# EAGLE design MainBoard (EAGLE 8.2.2)
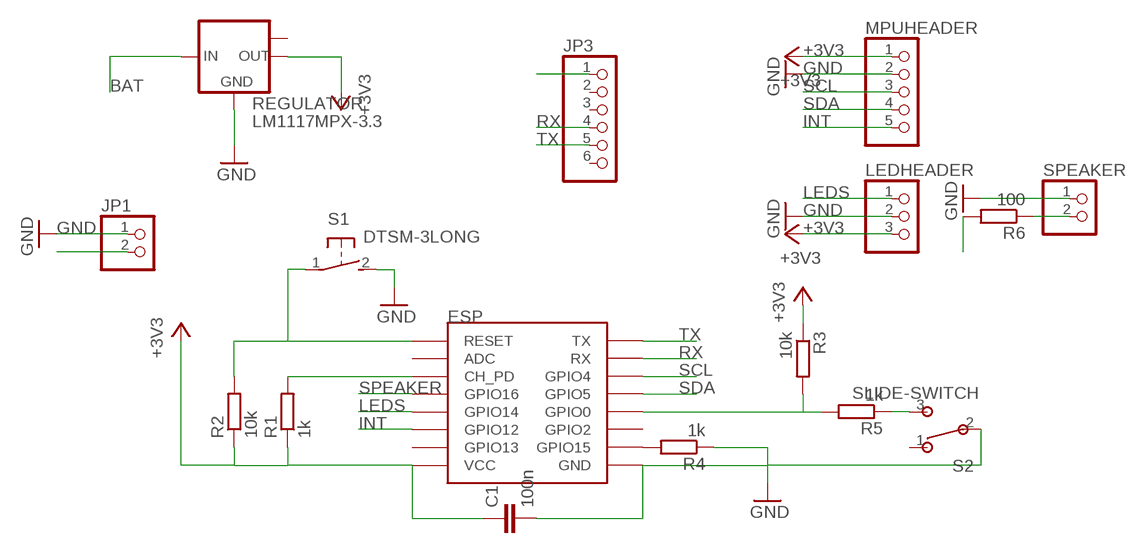
[diagram p0: schematic, sheet 1]

## Parts
C1  100n  C-EUC1206  [C1206]
ESP  ESP12SMD  [ESP12-SMD]
JP1  PINHD-1X2  [1X02]
JP3  PINHD-1X6  [1X06]
LEDHEADER  PINHD-1X3  [1X03]
MPUHEADER  PINHD-1X5  [1X05]
R1  1k  R-EU_R1206  [R1206]
R2  10k  R-EU_R1206  [R1206]
R3  10k  R-EU_R1206  [R1206]
R4  1k  R-EU_R1206  [R1206]
R5  1k  R-EU_R1206  [R1206]
R6  100  R-EU_R1206  [R1206]
REGULATOR  LM1117MPX-3.3  [SOT223]
S1  DTSM-3LONG  [DTSM-3LONG]
S2  SLIDE-SWITCH  [AYZ0102AGRLC]
SPEAKER  PINHD-1X2  [1X02]

## Nets
+3V3: C1.1 ESP.VCC LEDHEADER.3 MPUHEADER.1 R1.1 R2.1 R3.1 REGULATOR.2(OUT)
BAT: JP1.2 REGULATOR.3(IN)
GND: C1.2 ESP.GND JP1.1 JP3.1 LEDHEADER.2 MPUHEADER.2 R4.1 REGULATOR.1(GND) S1.2 S2.2 SPEAKER.1
INT: ESP.GPIO12 MPUHEADER.5
LEDS: ESP.GPIO14 LEDHEADER.1
N$1: ESP.GPIO0 R3.2 R5.2
N$2: ESP.CH_PD R1.2
N$3: ESP.RESET R2.2 S1.1
N$5: ESP.GPIO15 R4.2
N$9: R5.1 S2.3
N$11: R6.1 SPEAKER.2
RX: ESP.RXD0(RX) JP3.4
SCL: ESP.GPIO4 MPUHEADER.3
SDA: ESP.GPIO5 MPUHEADER.4
SPEAKER: ESP.GPIO16 R6.2
TX: ESP.TXD0(TX) JP3.5
Unconnected: ESP.ADC ESP.GPIO2 ESP.GPIO13 JP3.2 JP3.3 JP3.6 REGULATOR.TAB(OUT1) S2.1

## Library data of the parts
C1 = resistor:C-EU: CAPACITOR, European symbol
ESP = esp8266modules:ESP12: ESP8266 Wifi module 12
JP1 SPEAKER = pinhead:PINHD-1X2: PIN HEADER
JP3 = pinhead:PINHD-1X6: PIN HEADER
LEDHEADER = pinhead:PINHD-1X3: PIN HEADER
MPUHEADER = pinhead:PINHD-1X5: PIN HEADER
R1-R6 = resistor:R-EU_: RESISTOR, European symbol
REGULATOR = lm1117:LM1117MPX-*
S1 = switch-tact:DTSM-3
S2 = fab:SLIDE-SWITCH: SMD slide-switch AYZ0102AGRLC as found in the fablab inventory. Includes the mounting holes. Made by Zaerc.

## Board
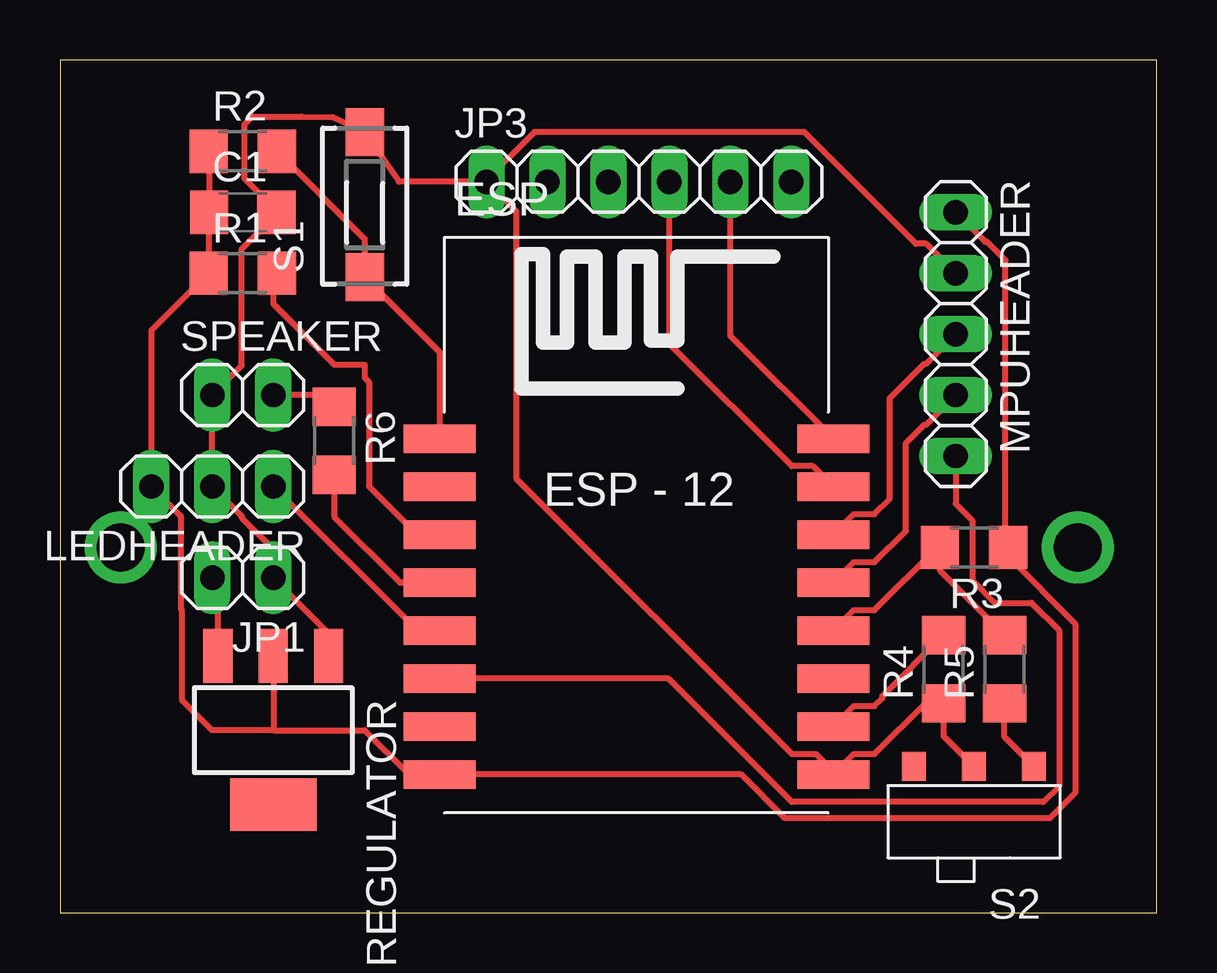
[diagram p1: board, top side]

Size 45.72 x 35.56 mm. Coordinates in mm from the lower left corner, seen from the top.
Outline: 0,0 45.72,0 45.72,35.56 0,35.56 0,0
Copper layers (1*16): Top 0.035mm / dielectric 1.5mm / Bottom 0.035mm
Design rules "fabmodule": minimum track width 10mil, minimum drill 0.4mm, track to track 0.42mm, track to pad 0.42mm, pad to pad 0.42mm, via to via 0.42mm, smd to smd 0.42mm, copper to edge 40mil, drill to drill 0.8mm, minimum pad ring 10mil, minimum via ring 8mil, stop-mask expansion 4mil, vias tented up to drill 0mil, thermal gap 10mil

### Footprints (pad centres in the part's own frame; a part is rotated, then mirrored left to right if it is on the bottom)
C1206 = smd 1.6 x 1.8: 1 -1.4,0; 2 1.4,0
ESP12-SMD = smd 3 x 1.2: ADC -8.3,3.8; CH_PD -8.3,1.8; GND 8.1,-8.2; GPIO0 8.1,-2.2; GPIO2 8.1,-4.2; GPIO4 8.1,1.8; GPIO5 8.1,-0.2; GPIO12 -8.3,-4.2; GPIO13 -8.3,-6.2; GPIO14 -8.3,-2.2; GPIO15 8.1,-6.2; GPIO16 -8.3,-0.2; RESET -8.3,5.8; RXD0 8.1,3.8; TXD0 8.1,5.8; VCC -8.3,-8.2
1X02 = drill 1.016 long: 1 -1.27,0; 2 1.27,0
1X06 = drill 1.016 long: 1 -6.35,0; 2 -3.81,0; 3 -1.27,0; 4 1.27,0; 5 3.81,0; 6 6.35,0
1X03 = drill 1.016 long: 1 -2.54,0; 2 0,0; 3 2.54,0
1X05 = drill 1.016 long: 1 -5.08,0; 2 -2.54,0; 3 0,0; 4 2.54,0; 5 5.08,0
R1206 = smd 1.6 x 1.803: 1 -1.422,0; 2 1.422,0
SOT223 = smd 1.219 x 2.235: 1 -2.311,-3.099; 2 0,-3.099; 3 2.311,-3.099 | smd 3.6 x 2.2: TAB 0,3.099
DTSM-3LONG = smd 2 x 1.6: 1 -2.7,0; 2 3.335,0
AYZ0102AGRLC = smd 1 x 1.2: 1 2.5,-2.3; 2 0,-2.3; 3 -2.5,-2.3

### Placement (x,y rotation side)
C1  7.62,29.21 0 top
ESP  24.13,13.97 0 top
JP1  7.62,13.97 180 top
JP3  24.13,30.48 0 top
LEDHEADER  6.35,17.78 180 top
MPUHEADER  37.34,24.13 270 top
R1  7.62,26.67 0 top
R2  7.62,31.75 0 top
R3  38.1,15.24 180 top
R4  36.83,10.16 90 top
R5  39.37,10.16 90 top
R6  11.43,19.68 270 top
REGULATOR  8.89,7.62 180 top
S1  12.7,29.21 90 top
S2  38.1,3.81 180 top
SPEAKER  7.62,21.59 0 top

### Tracks (layer width: path | path; a pad name or v marks a point on that pad's centre or on a via)
+3V3
  Top 0.254: R2.1 6.22,31.73 C1.1 6.2,29.19 R1.1 3.81,24.28 LEDHEADER.3 5.04,16.55 5.04,12.67 5.08,12.63 5.08,8.89 6.35,7.62 8.91,7.62 | ESP.VCC 15.7,5.77 | MPUHEADER.1 38.57,27.98 38.64,27.98 39.41,27.21 39.41,15.35 R3.1 39.52,14.86 42.32,12.06 42.32,5 41.27,3.95 30.22,3.95 28.4,5.77 ESP.VCC | 8.78,10.61 REGULATOR.2 8.91,10.69 8.91,7.62 | 8.91,7.62 12.7,7.62 14.55,5.77 ESP.VCC
BAT
  Top 0.254: JP1.2 6.58,13.74 REGULATOR.3
GND
  Top 0.254: S2.2 36.83,7.38 R4.1 36.07,8.74 33.96,6.62 33.08,6.62 32.3,5.84 | 32.3,5.84 ESP.GND | 32.3,5.84 31.52,6.62 30.5,6.62 19.01,18.11 19.01,29.25 JP3.1 17.71,30.48 | REGULATOR.1 11.2,11.66 JP1.1 8.89,15.17 7.58,16.48 7.58,16.55 LEDHEADER.2 SPEAKER.1 7.58,22.82 7.58,27.68 9.02,29.12 C1.2 9.02,29.3 7.7,30.62 7.7,32.88 8.02,33.2 10.07,33.2 11.36,33.18 S1.2 14.13,30.48 17.71,30.48 | MPUHEADER.2 36.11,27.9 35.67,27.9 31.02,32.55 19.78,32.55 17.71,30.48
INT
  Top 0.254: MPUHEADER.5 37.34,17.05 38.02,16.37 38.02,13.88 38.98,12.93 40.5,12.93 41.65,11.78 41.65,5.28 40.99,4.62 30.5,4.62 25.36,9.77 ESP.GPIO12
LEDS
  Top 0.254: LEDHEADER.1 14.9,11.77 ESP.GPIO14
N$1
  Top 0.254: ESP.GPIO0 33.08,12.62 33.96,12.62 36.57,15.24 R3.2 36.68,14.27 R5.2
N$2
  Top 0.254: R1.2 8.89,26.52 8.89,25.4 11.43,22.86 12.7,22.86 12.7,22.31 12.88,22.13 12.88,17.78 14.89,15.77 ESP.CH_PD
N$3
  Top 0.254: ESP.RESET 15.83,23.38 S1.1 12.7,28.09 R2.2
N$5
  Top 0.254: ESP.GPIO15 33.08,8.62 33.96,8.62 34.28,8.94 34.28,9.03 R4.2
N$6  (via drill 2 pad 2)
  other vias: 2.54,15.24
N$8  (via drill 2)
  other vias: 42.42,15.24
N$9
  Top 0.254: S2.3 39.37,7.34 R5.1
N$11
  Top 0.254: R6.1 10.95,21.59 SPEAKER.2
RX
  Top 0.254: ESP.RXD0 31.38,18.62 30.5,18.62 25.4,23.73 JP3.4
SCL
  Top 0.254: ESP.GPIO4 33.08,16.62 33.96,16.62 34.59,17.26 34.59,21.46 36.03,22.9 36.11,22.9 MPUHEADER.3
SDA
  Top 0.254: ESP.GPIO5 33.08,14.62 33.96,14.62 35.27,15.93 35.27,19.59 36.03,20.36 36.11,20.36 MPUHEADER.4
SPEAKER
  Top 0.254: R6.2 11.43,16.51 14.17,13.77 ESP.GPIO16
TX
  Top 0.254: ESP.TXD0 27.94,24.06 JP3.5